# EAGLE design GSRv2.1 (EAGLE 7.4.0)
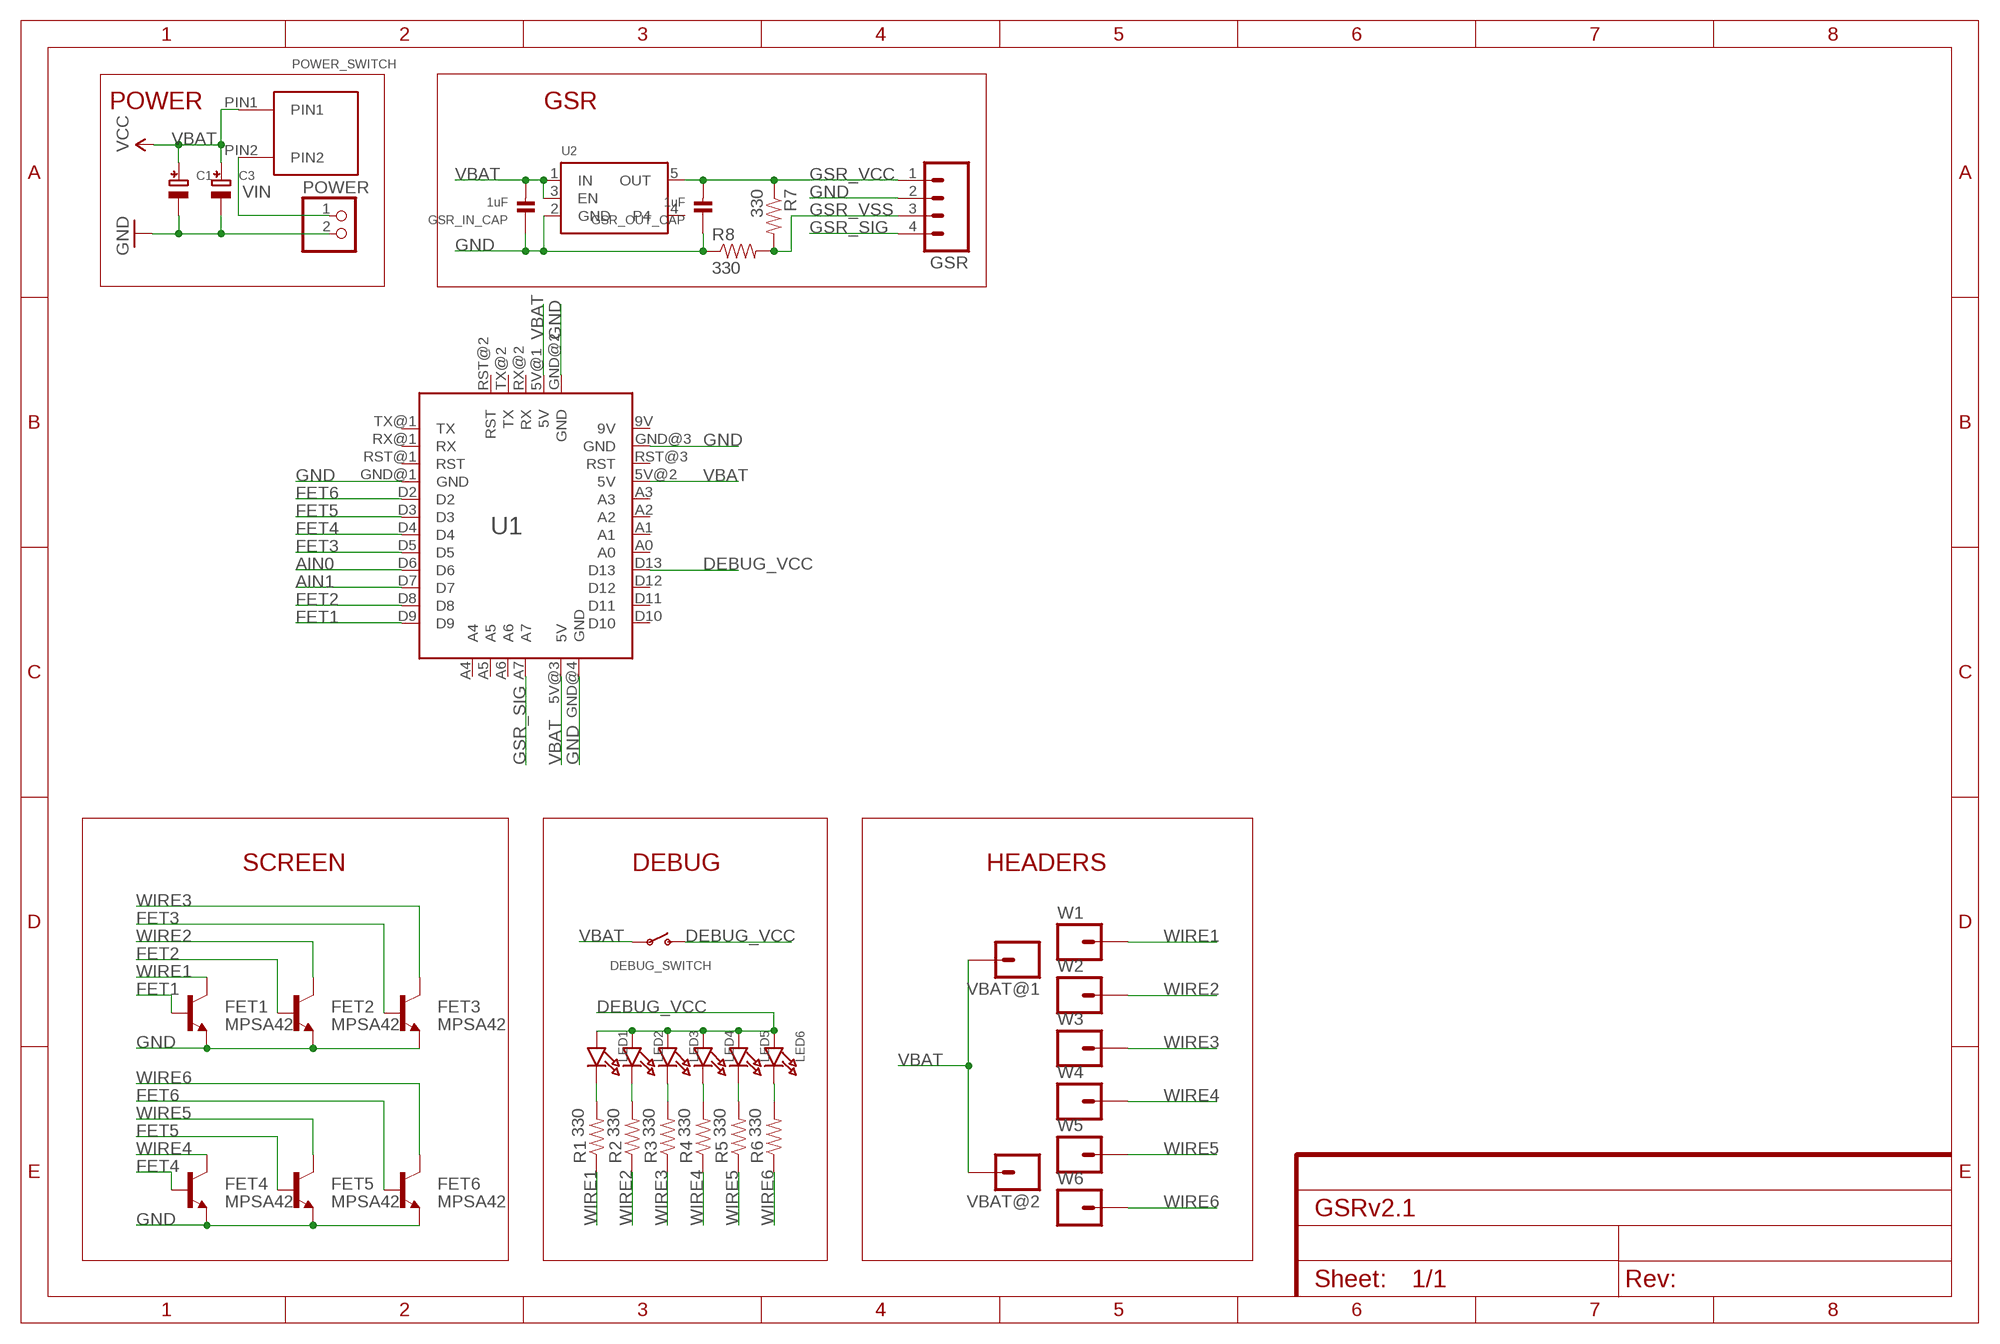
[diagram p0: schematic, sheet 1]

## Parts
C1  CAP_TANTALUMB/3528_WAVE  [EIA3528-21/B-W]
C3  CAP_TANTALUMB/3528_WAVE  [EIA3528-21/B-W]
DEBUG_SWITCH  SWITCH_SPST  [SPST_SMT_19192]
FET1  MPSA42  TRANSISTOR_NPNMPSA42  [SOT23-3]
FET2  MPSA42  TRANSISTOR_NPNMPSA42  [SOT23-3]
FET3  MPSA42  TRANSISTOR_NPNMPSA42  [SOT23-3]
FET4  MPSA42  TRANSISTOR_NPNMPSA42  [SOT23-3]
FET5  MPSA42  TRANSISTOR_NPNMPSA42  [SOT23-3]
FET6  MPSA42  TRANSISTOR_NPNMPSA42  [SOT23-3]
GSR  M04PTH  [1X04]
GSR_IN_CAP  1uF  CAP_CERAMIC0603  [0603]
GSR_OUT_CAP  1uF  CAP_CERAMIC0603  [0603]
LED1  LED0603_NOOUTLINE  [CHIPLED_0603_NOOUTLINE]
LED2  LED0603_NOOUTLINE  [CHIPLED_0603_NOOUTLINE]
LED3  LED0603_NOOUTLINE  [CHIPLED_0603_NOOUTLINE]
LED4  LED0603_NOOUTLINE  [CHIPLED_0603_NOOUTLINE]
LED5  LED0603_NOOUTLINE  [CHIPLED_0603_NOOUTLINE]
LED6  LED0603_NOOUTLINE  [CHIPLED_0603_NOOUTLINE]
POWER  JST_2PIN  [JSTPH2]
POWER_SWITCH  PUSH_BUTTON  [PUSH_BUTTON]
R1  330  RESISTOR0603-RES  [0603-RES]
R2  330  RESISTOR0603-RES  [0603-RES]
R3  330  RESISTOR0603-RES  [0603-RES]
R4  330  RESISTOR0603-RES  [0603-RES]
R5  330  RESISTOR0603-RES  [0603-RES]
R6  330  RESISTOR0603-RES  [0603-RES]
R7  330  0OHM-1/10W-5%(0603)  [0603]
R8  330  0OHM-1/10W-5%(0603)  [0603]
U1  ARDUINO_MINI  [ARDUINO_MINI]
U2  VREG_SOT23-5  [SOT23-5]
VBAT@1  M01NOSILK-KIT  [1X01NS-KIT]
VBAT@2  M01NOSILK-KIT  [1X01NS-KIT]
W1  M01NOSILK-KIT  [1X01NS-KIT]
W2  M01NOSILK-KIT  [1X01NS-KIT]
W3  M01NOSILK-KIT  [1X01NS-KIT]
W4  M01NOSILK-KIT  [1X01NS-KIT]
W5  M01NOSILK-KIT  [1X01NS-KIT]
W6  M01NOSILK-KIT  [1X01NS-KIT]

## Nets
AIN0: U1.D6
AIN1: U1.D7
DEBUG_VCC: DEBUG_SWITCH.C(S) LED1.A LED2.A LED3.A LED4.A LED5.A LED6.A U1.D13
FET1: FET1.1(B) U1.D9
FET2: FET2.1(B) U1.D8
FET3: FET3.1(B) U1.D5
FET4: FET4.1(B) U1.D4
FET5: FET5.1(B) U1.D3
FET6: FET6.1(B) U1.D2
GND: C1.- C3.- FET1.2(E) FET2.2(E) FET3.2(E) FET4.2(E) FET5.2(E) FET6.2(E) GSR.2 GSR_IN_CAP.1 GSR_OUT_CAP.1 POWER.2 R8.1 U1.GND@1(GND) U1.GND@2(GND) U1.GND@3(GND) U1.GND@4(GND) U2.2(GND)
GSR_SIG: GSR.4 U1.A7
GSR_VCC: GSR.1 GSR_OUT_CAP.2 R7.1 U2.5(OUT)
GSR_VSS: GSR.3 R7.2 R8.2
N$1: LED1.C R1.2
N$2: LED2.C R2.2
N$3: LED3.C R3.2
N$4: LED4.C R4.2
N$5: LED5.C R5.2
N$6: LED6.C R6.2
VBAT: C1.+ C3.+ DEBUG_SWITCH.B(P) GSR_IN_CAP.2 POWER_SWITCH.PIN1 U1.5V@1(5V) U1.5V@2(5V) U1.5V@3(5V) U2.1(IN) U2.3(EN) VBAT@1.1 VBAT@2.1 ; supply symbol labelled VCC
VIN: POWER.1 POWER_SWITCH.PIN2
WIRE1: FET1.3(C) R1.1 W1.1
WIRE2: FET2.3(C) R2.1 W2.1
WIRE3: FET3.3(C) R3.1 W3.1
WIRE4: FET4.3(C) R4.1 W4.1
WIRE5: FET5.3(C) R5.1 W5.1
WIRE6: FET6.3(C) R6.1 W6.1
Unconnected: U1.A0 U1.A1 U1.A2 U1.A3 U1.A4 U1.A5 U1.A6 U1.D10 U1.D11 U1.D12 U1.RST@1(RST) U1.RST@2(RST) U1.RST@3(RST) U1.RX@1(RX) U1.RX@2(RX) U1.TX@1(TX) U1.TX@2(TX) U2.4

## Notes on the sheet
- POWER | GSR
- SCREEN | DEBUG | HEADERS

## Power pins joined to a net without a drawn wire
9V: U1.9V

## Library data of the parts
C1 C3 = microbuilder:CAP_TANTALUM: Tantalum Capacitors Wave footprints have larger pads and are meant to be used for hand soldering. Reflow footprints are optimised for solder paste and a reflow oven. EIA3216-18/A-[R/W] - Size A / 3216-18 / 1206 footprint 4.7µF 25V 10% Tantalum Capacitor 10µF 16V 10% Tantalum Capacitor [Digikey: 495-2236-2-ND] EIA3528-21/B-[R/W] - Size B / 3528-21 47µF 10V 10% Tantalum Capactior [Digikey: 495-2216-1-ND] EIA6032-28/C-[R/W] - Size C / 6032-28 10µF 35V 20% Tantalum Capacitor [Digikey: 495-2285-1-ND] 100µF 16V 10% Tantalum Capactior [Digikey: 399-5214-1-ND]
DEBUG_SWITCH = microbuilder:SWITCH_SPST: Switch - SPST 4UCon 19192 (6.7x2.6mm SMT)
FET1-FET6 = SparkFun-DiscreteSemi:TRANSISTOR_NPN: Generic NPN BJT MMBT2222A - TRANS-08049 (SOT-23, 1A 40V) MPSA42 - TRANS-09116 (SOT-23, 500mA 300V) MMBT5088LT1G - TRANS-11160 (SOT-23, 50 mA 30V) BC547 - COM-08928 <http://www.sparkfun.com/products/8928> (TO-92 45V 100mA) (1.Collector 2.Base 3.Emitter) 2N3904 - COM-00521 <http://www.sparkfun.com/products/521> (TO-92 40V 200mA) (1.Emitter 2.Base 3.Collector) P2N2222A - COM-12852 <http://www.sparkfun.com/products/12852> (TO-92 40V 600mA) (1.Collector 2.Base 3.Emitter); PROD_ID: TRANS-09116
GSR = SparkFun-Connectors:M04: Header 4 Standard 4-pin 0.1" header. Use with straight break away headers (SKU : PRT-00116), right angle break away headers (PRT-00553), swiss pins (PRT-00743), machine pins (PRT-00117), and female headers (PRT-00115). Molex polarized connector foot print use with SKU : PRT-08231 with associated crimp pins and housings. 1MM SMD Version SKU: PRT-10208
GSR_IN_CAP GSR_OUT_CAP = microbuilder:CAP_CERAMIC: Ceramic Capacitors 0402 - 0402 Surface Mount Capacitors 16pF 50V 5% [Digikey: 445-4899-2-ND] 18pF 50V 5% [Digikey: 490-1281-2-ND] 22pF 50V 5% [Digikey: 490-1283-2-ND] 68pF 50V 5% [Digikey: 490-1289-2-ND] 0.1uF 10V 10% [Digikey: 490-1318-2-ND] 1.0uF 6.3V 10% [Digikey: 490-1320-2-ND] 0603 - 0603 Surface Mount Capacitors 16 pF 50V 5% [Digikey: 445-5051-2-ND] 22 pF 50V [Digikey: PCC220ACVTR-ND] 33 pF 50V 5% [Digikey: 490-1415-1-ND] 56pF 50V 5% [Digikey: 490-1421-1-ND] 220pF 50V 5% [Digikey: 445-1285-1-ND] 680 pF 50V 2200 pF 50V 5% C0G [Digikey: 445-1297-1-ND] 5600 pF 100V 5% X7R [Digikey: 478-3711-1-ND] 0.1 µF 25V 10% [Digikey: PCC2277TR-ND] 0.22 µF 16V 10% X7R [Digikey: 445-1318-1-ND] 1.0 µF 25V 10% [Digikey: 445-5146-2-ND] 0603 - RF Specific 3pF 250V +/-0.1pF RF [Digikey: 712-1347-1-ND] 18 pF 250V 5% [Digikey: 478-3505-1-ND or 712-1322-1-ND] 56 pF 250V 5% C0G RF [Digikey: 490-4867-1-ND] 68 pF 250V RF [Digikey: 490-4868-1-ND] 0805 - 0805 Surface Mount Capacitors 220 pF 250V 2% RF Ceramic Capacitor [Digikey: 712-1398-1-ND] 1000 pF 50V 2% NP0 Ceramic Capacitor [Digikey: 478-3760-1-ND] 0.1 µF 25V 10% Ceramic Capacitor [Digikey: PCC1828TR-ND] 1.0 µF 16V 10% Ceramic Capacitor[Digikey: 490-1691-2-ND] 10.0 µF 10V 10% Ceramic Capacitor[Digikey: 709-1228-1-ND] 10.0 uF 16V 10% Ceramic Capacitor [Digikey: 478-5165-2-ND] 47 uF 6.3V 20% Ceramic Capacitor [Digikey: 587-1779-1-ND or 399-5506-1-ND] 1206 - 1206 Surface Mount Capacitors 47uF 10V 20% Ceramic Capacitor [Digikey: 490-5528-1-ND or 399-5508-1-ND or 445-6010-1-ND] 100uF 6.3V -20%, +80% Y5V Ceramic Capacitor (Digikey: 490-4512-1-ND, Mouser: 81-GRM31CF50J107ZE1L)
LED1-LED6 = microbuilder:LED: LED 0603 - 0603 Surface Mount Package 2mA: Green LED - Low Power (3.9mcd, 2ma, 1.7Vf) - Digikey: 475-2709-2-ND Orange LED - Low Power (9.8mcd, 2ma, 1.8Vf) - Digikey: 475-1194-2-ND Red LED - Low Power (5mcd, 2ma, 1.8Vf) - Digikey: 475-1195-2-ND Yellow LED - Low Power (7mcd, 2ma, 1.8Vf) - Digikey: 475-1196-2-ND 5mA: Blue LED - Low Power (17mcd, 5ma, 2.9Vf) - Digikey: LNJ937W8CRACT-ND 0805 - 0805 Surface Mount Package 2mA: Red LED (8.8mcd, 2mA, 1.8Vf, Clear) - Low Power [Digikey: 475-2510-1-ND] Green LED (5mcd, 2mA, 1.8Vf, Clear) - Low Power [Digikey: 475-2730-1-ND] Yellow LED (11.3mcd, 2mA, 1.8Vf, Clear) - Low Power [Digikey: 475-2555-1-ND] 20mA: Red LED (104mcd, 20mA, Diffused) - LS R976 [Digikey: 475-1278-6-ND] Red LED (12mcd, 20mA, 2.0Vf, Clear) - APT2012EC [Digikey: 754-1128-1-ND] Green LED (15mcd, 20mA, 2.2Vf, Clear) - APT2012GC [Digikey: 754-1131-1-ND] Orange LED (160mcd, 20mA, 2.1Vf, Clear) - APT2012SECK [Digikey: 754-1130-1-ND] 1206 - 1206 Surface Mount Package Green LED (26mcd, 20mA, Diffused) - LG N971 [Digikey: 475-1407-6-ND] Red LED (15mcd, 20mA, Diffused) - LH N974 [Digikey: 475-1416-6-ND]
POWER = microbuilder:JST_2PIN: JST 2-Pin Right-Angle Connector PH-Series - 4UConnector: 17311 SH-Series - 4UConnector: 07278
POWER_SWITCH = myParts:PUSH_BUTTON
R1-R6 = SparkFun-Passives:RESISTOR: Resistor Basic schematic elements and footprints for 0603, 1206, and PTH resistors.
R7 R8 = SparkFun-Resistors:0OHM-1/10W-5%(0603): RES-08609; PROD_ID: RES-08609; VALUE: 0
U1 = myParts:ARDUINO_MINI: Arduino Mini V5 Footprint
U2 = microbuilder:VREG_SOT23-5: SOT23-5 Fixed Voltage Regulators To better organise some of the SOT23-5 fixed voltage regulators in this library, this new part was created. Part Current Out V Out V In V Dropout Digikey Part No. ADP121 150mA 3.3V 3.4-5.5V 0.09V @ 150mA ADP121-AUJZ33R7CT-ND ADP121 150mA 3.0V 3.1-5.5V 0.09V @ 150mA ADP121-AUJZ30R7CT-ND ADP122 300mA 3.3V 3.4-5.5V 0.085V @ 300mA ADP122AUJZ-3.3-R7CT-ND ADP1712 300mA 3.3V 3.5-5.5V 0.17V @ 300mA ADP1712AUJZ-3.3-R7TR-ND AP7311 (Low Cost) 150mA 3.3V 3.5-6V 0.15V @ 150mA AP7311-33WG-7DICT-ND LD39015M18R 150mA 1.8V 1.9V-5.5V 0.08V @ 100mA 497-6977-1-ND MCP1824T-3302E/OT 300mA 3.3V 3.5V-6V 0.2V @ 300mA MCP1824T-3302E/OTCT-ND MIC5205-2.5YM5 TR 150mA 2.5V 2.7-16V 0.165V @ 150mA 576-1257-2-ND MIC5205-3.0YM5 TR 150mA 3.0V 3.2V-16V 0.165V @ 150mA 576-1258-2-ND MIC5205-3.3YM5 TR 150mA 3.3V 3.5V-16V 0.165V @ 150mA 576-1259-2-ND TPS780330220 150mA 3.3V+2.2V 3.6-5.5V 250mV Max 296-23332-1-ND TDA3663/N1,135 100mA 3.3V 3.5-45V 0.18V @ 50mA 568-5343-1-ND
VBAT@1 VBAT@2 W1-W6 = SparkFun-Connectors:M01: Header 1 Standard 1-pin 0.1" header. Use with straight break away headers (SKU : PRT-00116), right angle break away headers (PRT-00553), swiss pins (PRT-00743), machine pins (PRT-00117), and female headers (PRT-00115).

## Board
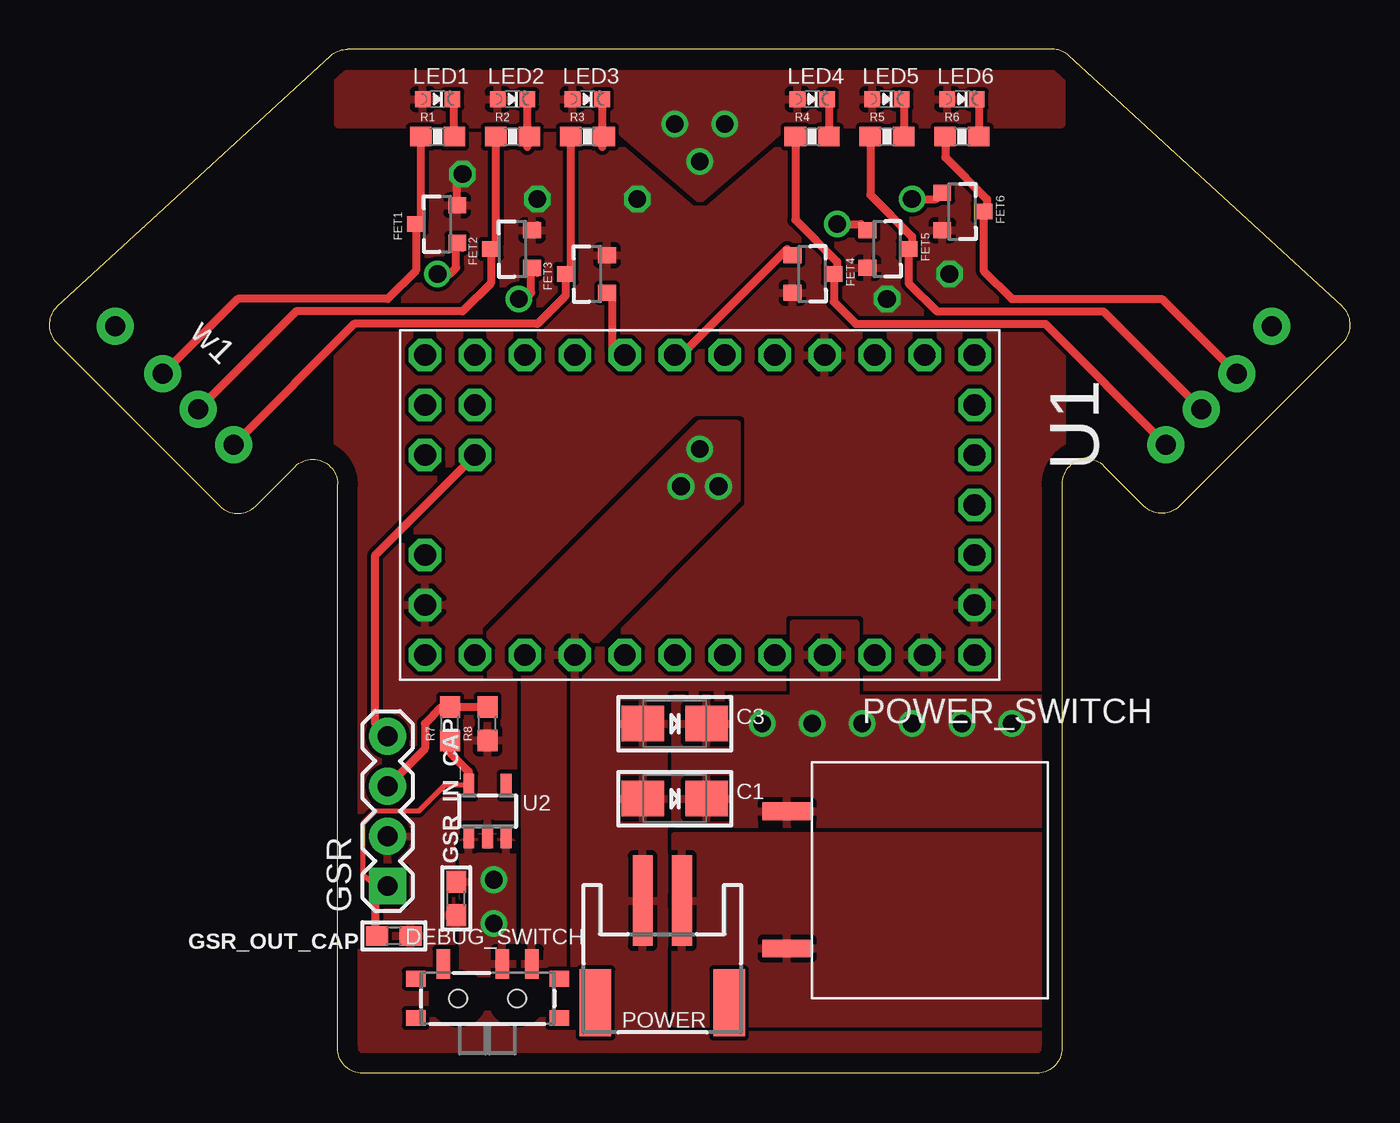
[diagram p1: board, top side]
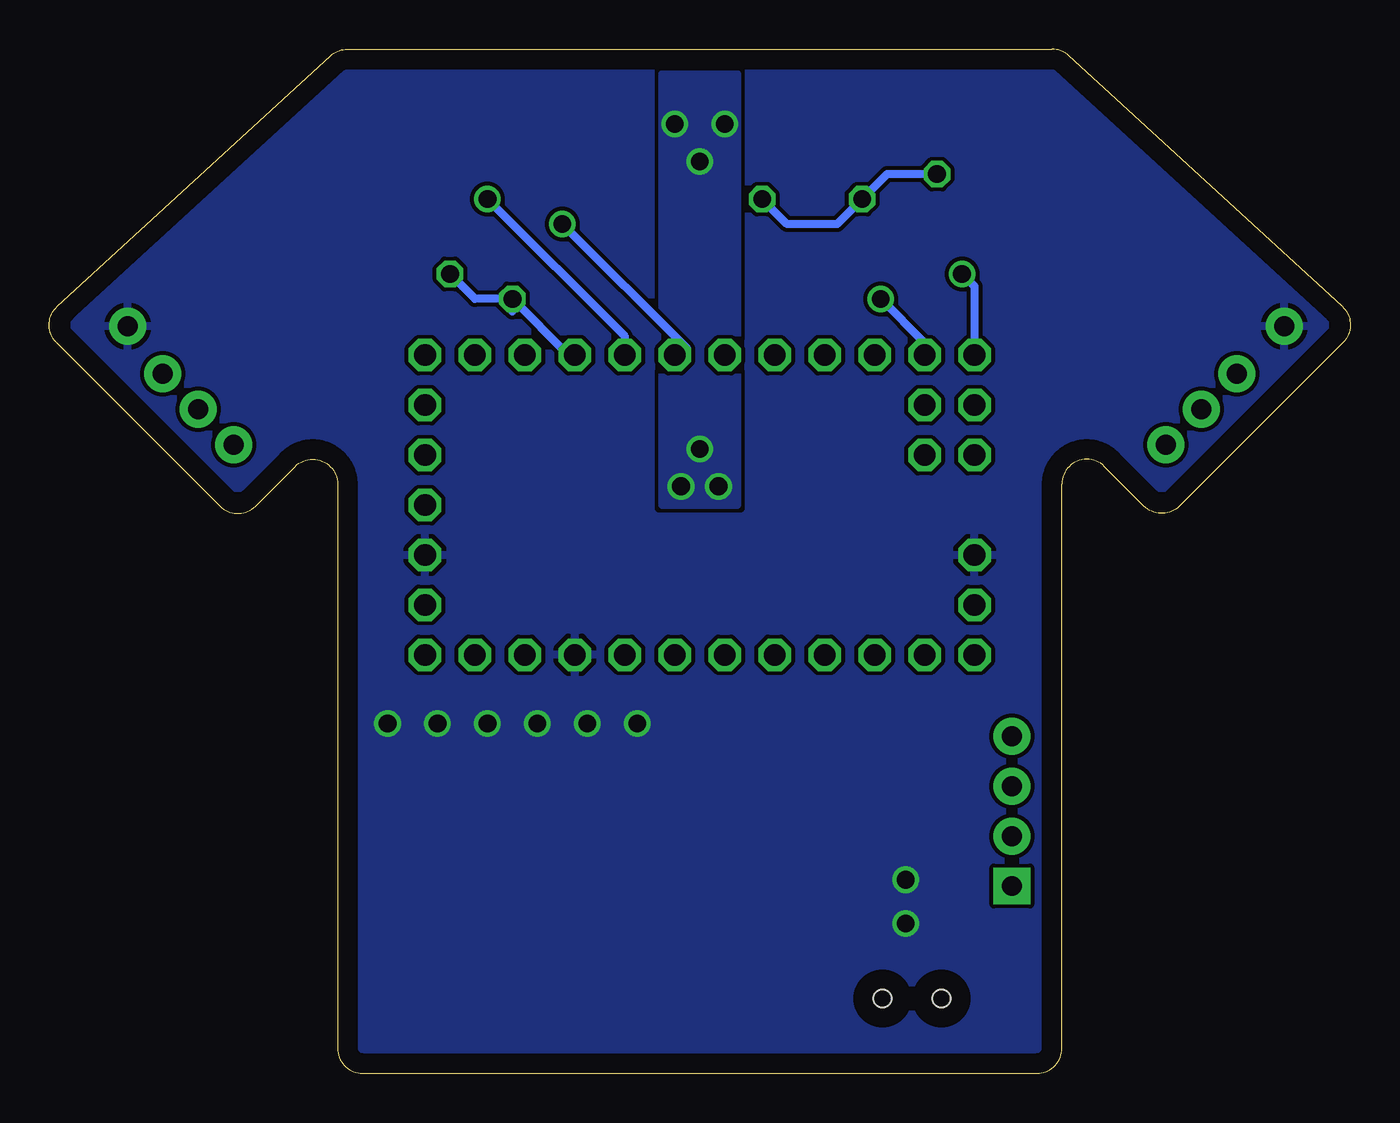
[diagram p2: board, bottom side, seen from below]

Size 66.18 x 52.07 mm. Coordinates in mm from the lower left corner, seen from the top.
Outline: 0.41,39 14.31,51.74 arc-43 15.17,52.07 51.01,52.07 arc-43 51.87,51.74 65.77,39 arc-92 65.81,37.16 57.48,28.84 arc-90 55.69,28.84 53.67,30.85 arc135 51.5,29.95 51.5,1.27 arc-90 50.23,0 15.94,0 arc-90 14.67,1.27 14.67,29.95 arc135 12.51,30.85 10.49,28.84 arc-90 8.7,28.84 0.37,37.16 arc-92 0.41,39
Copper layers (1*16): Top 0.035mm / dielectric 1.5mm / Bottom 0.035mm
Design rules "default": minimum track width 10mil, minimum drill 24mil, track to track 8mil, track to pad 8mil, pad to pad 8mil, via to via 8mil, smd to smd 8mil, copper to edge 40mil, drill to drill 8mil, minimum pad ring 10mil, minimum via ring 8mil, stop-mask expansion 4mil, vias tented up to drill 0mil, thermal gap 10mil

### Footprints (pad centres in the part's own frame; a part is rotated, then mirrored left to right if it is on the bottom)
EIA3528-21/B-W = smd 2.15 x 1.8: + 1.625,0; - -1.625,0
SPST_SMT_19192 = smd 0.7 x 1.5: A -2.25,1.75; B 0.75,1.75; C 2.25,1.75 | smd 1 x 0.8: GND1 -3.65,1; GND2 -3.65,-1; GND3 3.65,1; GND4 3.65,-1 | hole 0.9: -1.5,0; 1.5,0
SOT23-3 = smd 0.8 x 0.9: 1 -0.95,-1; 2 0.95,-1; 3 0,1.1
1X04 = drill 1.016 pad 1.88 square: 1 0,0 | drill 1.016 pad 1.88: 2 2.54,0; 3 5.08,0; 4 7.62,0
0603 = smd 1.1 x 1: 1 -0.85,0; 2 0.85,0
CHIPLED_0603_NOOUTLINE = smd 0.8 x 0.8: A 0,-0.75; C 0,0.75
JSTPH2 = smd 1 x 4.6: 1 -1,-3.7; 2 1,-3.7 | smd 1.6 x 3.4: NC1 -3.4,1.5; NC2 3.4,1.5
PUSH_BUTTON = smd 2.5 x 0.9: PIN1 -13.97,-0.644; PIN2 -13.97,-7.62
0603-RES = smd 1.1 x 1: 1 -0.85,0; 2 0.85,0
ARDUINO_MINI = drill 1.1 octagon: 5V@1 2.54,15.24; 5V@2 7.62,7.62; 5V@3 2.54,-12.7; 9V 7.62,15.24; A0 7.62,-2.54; A1 7.62,0; A2 7.62,2.54; A3 7.62,5.08; A4 -5.08,-12.7; A5 -2.54,-12.7; A6 -5.08,-10.16; A7 -2.54,-10.16; D2 -7.62,5.08; D3 -7.62,2.54; D4 -7.62,0; D5 -7.62,-2.54; D6 -7.62,-5.08; D7 -7.62,-7.62; D8 -7.62,-10.16; D9 -7.62,-12.7; D10 7.62,-12.7; D11 7.62,-10.16; D12 7.62,-7.62; D13 7.62,-5.08; GND@1 -7.62,7.62; GND@2 5.08,15.24; GND@3 7.62,12.7; GND@4 5.08,-12.7; RST@1 -7.62,10.16; RST@2 -5.08,15.24; RST@3 7.62,10.16; RX@1 -7.62,12.7; RX@2 0,15.24; TX@1 -7.62,15.24; TX@2 -2.54,15.24
SOT23-5 = smd 0.55 x 1.2: 1 -0.95,-1.3; 2 0,-1.3; 3 0.95,-1.3; 4 0.95,1.3; 5 -0.95,1.3
1X01NS-KIT = drill 1.016 pad 1.88: 1 0,0

### Placement (x,y rotation side)
C1  31.82,13.97 0 top
C3  31.82,17.78 0 top
DEBUG_SWITCH  22.29,3.81 0 top
FET1  19.75,43.18 90 top
FET2  23.56,41.91 90 top
FET3  27.37,40.64 90 top
FET4  38.8,40.64 270 top
FET5  42.61,41.91 270 top
FET6  46.42,43.81 270 top
GSR  17.21,9.53 90 top
GSR_IN_CAP  20.71,8.89 90 top
GSR_OUT_CAP  17.53,6.99 180 top
LED1  19.75,49.53 270 top
LED2  23.56,49.53 270 top
LED3  27.37,49.53 270 top
LED4  38.8,49.53 270 top
LED5  42.61,49.53 270 top
LED6  46.42,49.53 270 top
POWER  31.18,5.08 180 top
POWER_SWITCH  51.5,13.97 0 top
R1  19.75,47.62 0 top
R2  23.56,47.62 0 top
R3  27.37,47.62 0 top
R4  38.8,47.62 0 top
R5  42.61,47.62 0 top
R6  46.42,47.62 0 top
R7  20.39,17.78 90 top
R8  22.29,17.78 90 top
U1  31.82,28.89 270 top
U2  22.29,13.34 0 top
VBAT@1  3.35,37.99 135 top
VBAT@2  62.19,37.99 315 top
W1  5.78,35.56 45 top
W2  7.58,33.76 45 top
W3  9.38,31.97 45 top
W4  56.8,31.97 315 top
W5  58.6,33.76 315 top
W6  60.39,35.56 315 top

### Tracks (layer width: path | path; a pad name or v marks a point on that pad's centre or on a via)
DEBUG_VCC  (via drill 0.9)
  other vias: 33.09,31.75 32.14,29.84 34.04,29.84 33.09,46.35 31.82,48.26 34.36,48.26
  pour Bottom: 34.99,28.89 34.99,50.8 31.18,50.8 31.18,28.89
  pour Top: 33.09,44.45 37.53,48.26 51.5,48.26 51.5,50.8 14.67,50.8 14.67,48.26 28.64,48.26
  pour Top: 20.39,20.32 27.37,20.32 27.37,21.59 34.99,29.21 34.99,33.02 33.09,33.02
  pour Top: 24.2,5.08 24.2,21.59 26.1,21.59 26.1,5.08
FET1  (via drill 0.9)
  Top 0.406: 21.02,41.96 FET1.1 20.71,42.18 20.71,40.96 20.39,40.64 v19.75,40.64
  Bottom 0.406: v19.75,40.64 19.12,40.01 U1.D9
FET2  (via drill 0.9)
  Top 0.406: 24.83,40.69 FET2.1 24.52,40.91 24.52,39.69 24.2,39.37 v23.88,39.37
  Bottom 0.406: U1.D8 21.66,37.15 v23.88,39.37
FET3
  Top 0.406: U1.D5 28.96,36.51 28.64,36.83 28.64,39.42 FET3.1
FET4
  Top 0.406: 37.8,41.55 FET4.1 37.53,41.86 37.53,41.91 32.14,36.51 U1.D4
FET5  (via drill 0.9)
  Top 0.406: v40.07,43.18 41.29,43.18 FET5.1
  Bottom 0.406: U1.D3 33.72,36.83 v40.07,43.18
FET6  (via drill 0.9)
  Top 0.406: v43.88,44.45 45.1,44.45 FET6.1
  Bottom 0.406: U1.D2 36.9,37.46 v43.88,44.45
GND  (via drill 0.9)
  Top 0.406: FET1.2 20.75,45.45 v21.02,45.72 | FET2.2 24.83,43.13
  Bottom 0.406: v42.61,39.37 42.61,38.73 | v21.02,45.72 23.56,45.72 v24.83,44.45 26.1,43.18 28.64,43.18 v29.91,44.45 | U1.GND@1 39.76,36.51 v42.61,39.37 | 45.15,40.01 v45.79,40.64 44.52,39.37 v42.61,39.37
  pour Top (rank 3): 14.67,58.42 51.5,58.42 51.5,-6.35 14.67,-6.35
GSR_SIG
  Top 0.406: GSR.4 16.58,17.78 16.58,26.35 U1.A7
GSR_VCC
  Top 0.254: U2.5 20.1,14.64 18.8,13.34 16.58,13.34 15.94,12.7 15.94,10.16 16.58,9.53 GSR.1
  Top 0.406: R7.1 20.07,16.61 21.34,15.34 U2.5 | 16.58,9.53 16.58,7.09 GSR_OUT_CAP.2
GSR_VSS
  Top 0.406: R8.2 R7.2 19.97,18.63 19.12,17.78 19.12,16.51 GSR.3
N$1
  Top 0.406: R1.2 20.6,49.43 LED1.C
N$2
  Top 0.406: LED2.C 24.31,47.09 R2.2
N$3
  Top 0.406: LED3.C 28.12,47.09 R3.2
N$4
  Top 0.406: LED4.C 39.65,49.43 R4.2
N$5
  Top 0.406: LED5.C 43.46,49.43 R5.2
N$6
  Top 0.406: LED6.C 47.27,49.43 R6.2
VBAT  (via drill 0.9)
  other vias: 22.61,9.84 22.61,7.62 41.34,17.78 38.8,17.78 36.26,17.78 43.88,17.78 46.42,17.78 48.96,17.78
  pour Bottom (rank 2): -6.92,55.88 76.9,54.61 76.9,-3.81 -6.92,-2.54
  pour Top: 51.5,19.05 41.03,19.05 41.03,22.86 37.85,22.86 37.85,19.05 31.82,19.05 31.82,12.7 51.5,12.7
  pour Top: 23.56,11.75 21.02,11.75 21.02,5.08 23.56,5.08
VIN
  pour Top: 51.5,12.07 31.82,12.07 31.82,2.54 51.5,2.54
WIRE1
  Top 0.406: W1.1 9.59,39.37 17.21,39.37 18.65,40.81 FET1.3 18.9,43.43 R1.1
WIRE2
  Top 0.406: W2.1 12.55,38.73 21.02,38.73 22.46,40.17 FET2.3 22.71,42.16 R2.1
WIRE3
  Top 0.406: W3.1 15.51,38.1 24.83,38.1 26.27,39.54 FET3.3 26.52,40.89 R3.1
WIRE4
  Top 0.406: W4.1 50.67,38.1 41.03,38.1 39.9,39.22 FET4.3 40.07,40.81 40.07,41.27 37.95,43.39 R4.1
WIRE5
  Top 0.406: W5.1 53.63,38.73 45.15,38.73 43.71,40.17 FET5.3 43.88,42.08 43.88,42.55 41.76,44.66 R5.1
WIRE6
  Top 0.406: W6.1 56.58,39.37 48.96,39.37 47.52,40.81 FET6.3 47.69,43.98 47.69,44.45 45.57,46.57 R6.1

### Text on the board
tSilk: w1